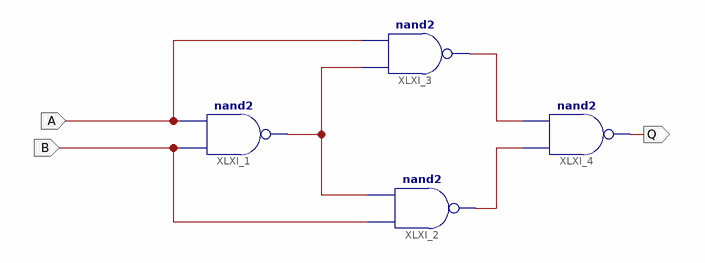
[diagram p0: schematic sheet 1]
// Xilinx ISE schematic Lab4Exp1.sch (spartan3e) as structural Verilog: 4 symbols, 3 ports
module Lab4Exp1 (
  input  A,
  input  B,
  output Q
);

  wire XLXN_4, XLXN_8, XLXN_9;

  nand XLXI_1 (XLXN_4, B, A);
  nand XLXI_2 (XLXN_9, B, XLXN_4);
  nand XLXI_3 (XLXN_8, XLXN_4, A);
  nand XLXI_4 (Q, XLXN_9, XLXN_8);
endmodule
